# Altium schematic sheet PCBdesign.SchDoc
size A4; Author: Eyke Liegmann; CompanyName: Technische Universität München; Address1: Arcisstr. 21; Address2: 80333 München; Address3: GERMANY; SheetNumber: 1; SheetTotal: 3; CompanyName2: TU München
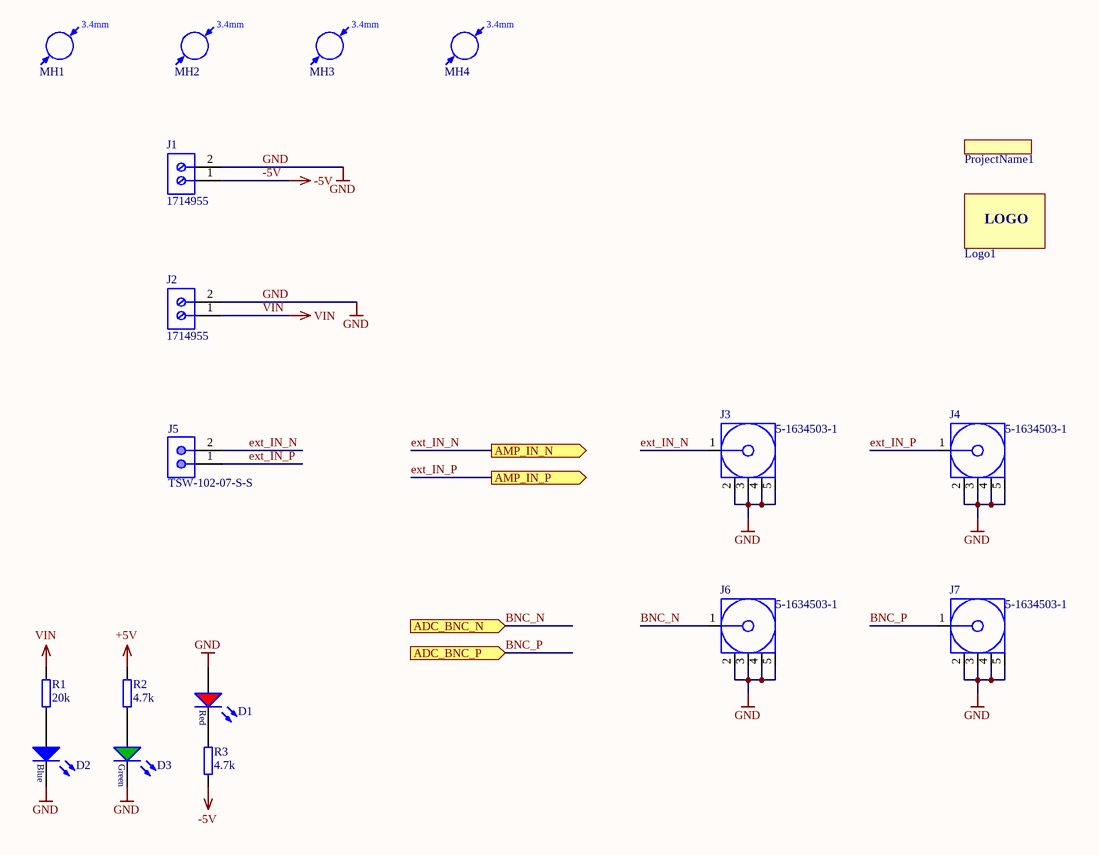
[diagram p0: PCBdesign.SchDoc]

## Parts
D1  150060RS75000  [WL-SMCW_0603]  (value not drawn)
D2  150060BS75000  [WL-SMCW_0603]  (value not drawn)
D3  150060GS75000  [WL-SMCW_0603]  (value not drawn)
J1  1714955  [PHOE-1714955_V]
J2  1714955  [PHOE-1714955_V]
J3  5-1634503-1  [TECO-5-1634503-1_V]
J4  5-1634503-1  [TECO-5-1634503-1_V]
J5  TSW-102-07-S-S  [SMTC-TSW-102-07-S-S]
J6  5-1634503-1  [TECO-5-1634503-1_V]
J7  5-1634503-1  [TECO-5-1634503-1_V]
Logo1  (no value)  [LOGO_Tum]
MH1  mounting hole 3,4mm  [MH_3.4]  (value not drawn)
MH2  mounting hole 3,4mm  [MH_3.4]  (value not drawn)
MH3  mounting hole 3,4mm  [MH_3.4]  (value not drawn)
MH4  mounting hole 3,4mm  [MH_3.4]  (value not drawn)
ProjectName1  Project Name, Rev  [ID_ProjectRev]  (value not drawn)  (no BOM)
R1  20k  [RESC1608X06N]
R2  4.7k  [RESC1608X06N]
R3  4.7k  [RESC1608X06N]

## Ports
ADC_BNC_N (in), ADC_BNC_P (in), AMP_IN_N (out), AMP_IN_P (out)

## Nets
+5V: R2.2
-5V: J1.1 R3.1
GND: D1.2(A) D2.1(K) D3.1(K) J1.2 J2.2 J3.2 J3.3 J3.4 J3.5 J4.2 J4.3 J4.4 J4.5 J6.2 J6.3 J6.4 J6.5 J7.2 J7.3 J7.4 J7.5
VIN: J2.1 R1.2
BNC_N: J6.1 ; port ADC_BNC_N
BNC_P: J7.1 ; port ADC_BNC_P
ext_IN_N: J3.1 J5.2 ; port AMP_IN_N
ext_IN_P: J4.1 J5.1 ; port AMP_IN_P
NetD1_1: D1.1(K) R3.2
NetD2_2: D2.2(A) R1.1
NetD3_2: D3.2(A) R2.1

## Notes on the sheet
- Title
- Size:
- Date:
- A4
- Revision:
- Time:
- Sheet
- of
- Author:
- Project:
- (in symbol Logos) LOGO
- (in symbol Mounting Hole) 3.4mm

## Library data of the parts
D1 = LED_Red_0603: WL-SMCW SMD Mono-color Chip LED Waterclear, size 0603, Red, 2 V, 140°; Forward Voltage: 2 V; Luminous Intensity: 250 mcd; Peak Wavelength: 630 nm; Dominant Wavelength: 625 nm; MF: Wuerth Elektronik; Published Date: Sep. 2017; ComponentLink1Description: Manufacturer; ComponentLink1URL: http://www.we-online.de; ComponentLink2Description: Datasheet; ComponentLink2URL: http://katalog.we-online.com/led/datasheet/150060RS75000.pdf; MPN: 150060RS75000; Size: 0603; Viewing Angle: 140°; Emitting Color: Red; Value: 150060RS75000; Package: 0603; Created: 2018_09_06_AGeiger; Supplier 1: Farnell; Supplier Part Number 1: 2322071; Supplier 2: Mouser; Supplier Part Number 2: 710-150060RS75000; Supplier 3: Digi-Key; Supplier Part Number 3: 732-4978-1-ND
D2 = LED_Blue_0603: WL-SMCW SMD Mono-color Chip LED Waterclear, size 0603, Blue, 3.2 V, 140°; Forward Voltage: 3.2 V; Luminous Intensity: 145 mcd; Peak Wavelength: 465 nm; Dominant Wavelength: 470 nm; MF: Wuerth Elektronik; Published Date: Sep. 2017; ComponentLink1Description: Manufacturer; ComponentLink1URL: http://www.we-online.de; ComponentLink2Description: Datasheet; ComponentLink2URL: http://katalog.we-online.com/led/datasheet/150060BS75000.pdf; MPN: 150060BS75000; Size: 0603; Viewing Angle: 140°; Emitting Color: Blue; Value: 150060BS75000; Package: 0603; Created: 2018_09_06_AGeiger; Supplier 1: Farnell; Supplier Part Number 1: 2322069; Supplier 2: Mouser; Supplier Part Number 2: 710-150060BS75000; Supplier 3: Digi-Key; Supplier Part Number 3: 732-4966-1-ND
D3 = LED_Green_0603: WL-SMCW SMD Mono-color Chip LED Waterclear, size 0603, Green, 3.2 V, 140°; Forward Voltage: 3.2 V; Luminous Intensity: 430 mcd; Peak Wavelength: 515 nm; Dominant Wavelength: 520 nm; MF: Wuerth Elektronik; Published Date: Sep. 2017; ComponentLink1Description: Manufacturer; ComponentLink1URL: http://www.we-online.de; ComponentLink2Description: Datasheet; ComponentLink2URL: http://katalog.we-online.com/led/datasheet/150060GS75000.pdf; MPN: 150060GS75000; Size: 0603; Viewing Angle: 140°; Emitting Color: Green; Value: 150060GS75000; Package: 0603; Created: 2018_09_06_AGeiger; Supplier 1: Farnell; Supplier Part Number 1: 2322070; Supplier 2: Mouser; Supplier Part Number 2: 710-150060GS75000; Supplier 3: Digi-Key; Supplier Part Number 3: 732-4971-1-ND
J1 J2 = 1714955: Conn Terminal Blocks 2 POS 6.35mm Solder ST Thru-Hole 32A; Manufacturer: Phoenix Contact; Max Supply Voltage: 500V; Voltage Rating: 630V; Number of Poles: 2; Number of Levels: 1; Current: 30A; Voltage: 300V; Gender: Male; Connector Type: PCB,Terminal Block; Wire Gauge (Max): 24AWG; Wire Gauge (Min): 10AWG; Stripping Length: 8mm; Approvals: UL,CSA,cULus; Supplier 1: Mouser; Manufacturer Part Number: 1714955; RoHS: Yes; Category: Terminal Blocks; Stock 1: 477; Mount: Through Hole; Number of Pins: 2; Weight: 0.197534oz; Color: Green; Housing Material: Polyamide; Housing Color: Green; Material: Polyamide; Insulation Material: Nylon; Contact Material: Tin; Package Quantity: 50; Packaging: Bulk; Termination: Screw; Max Current Rating: 32A; Current Rating: 32A; Number of Rows: 1; Orientation: Straight; Number of Positions Per Level: 2; Number of Positions: 2; Number of Contacts: 2; Number of Circuits: 2; Length: 12.7mm; Height: 26.6mm; Width: 26.6mm; Pitch: 6.35mm; Depth: 12.5mm; Wire/Cable Gauge: 24AWG; Radiation Hardening: No; Lead Free: Lead Free; Flammability Rating: UL94 V-0; REACH SVHC: No SVHC; ComponentLink1URL: https://datasheet.ciiva.com/16071/1714955-16071953.pdf?src-supplier=Onlinecomponents.com; ComponentLink1Description: https://datasheet.ciiva.com/16071/1714955-16071953.pdf?src-supplier=Onlinecomponents.com; ComponentLink2URL: https://datasheet.ciiva.com/824/1714955-824307.pdf?src-supplier=Digi-Key; ComponentLink2Description: https://datasheet.ciiva.com/824/1714955-824307.pdf?src-supplier=Digi-Key; ComponentLink3URL: https://datasheet.ciiva.com/1120/100944-1120389.pdf?src-supplier=Farnell; ComponentLink3Description: https://datasheet.ciiva.com/1120/100944-1120389.pdf?src-supplier=Farnell; ComponentLink4URL: https://datasheet.ciiva.com/15169/getdatasheetpartid-177883-15169653.pdf?src-supplier=Verical; ComponentLink4Description: https://datasheet.ciiva.com/15169/getdatasheetpartid-177883-15169653.pdf?src-supplier=Verical; ComponentLink5URL: https://datasheet.ciiva.com/1118/100944-1118422.pdf?src-supplier=Element14; ComponentLink5Description: https://datasheet.ciiva.com/1118/100944-1118422.pdf?src-supplier=Element14; ComponentLink6URL: https://datasheet.ciiva.com/14607/70054427-14607514.pdf?src-supplier=Allied+Electronics; ComponentLink6Description: https://datasheet.ciiva.com/14607/70054427-14607514.pdf?src-supplier=Allied+Electronics; ComponentLink7URL: https://datasheet.ciiva.com/29218/744545-da-01-en-printklemme-mkds-5-2-6-35-29218282.pdf?src-supplier=Conrad; ComponentLink7Description: https://datasheet.ciiva.com/29218/744545-da-01-en-printklemme-mkds-5-2-6-35-29218282.pdf?src-supplier=Conrad; Supplier Part Number 1: 651-1714955
J3 J4 J6 J7 = 5-1634503-1: BNC Str PCB Skt 50Ohm Nickel Pltd; Manufacturer: TE Connectivity; Dielectric Material: Polymethylpentene; Body Material: Zinc; Impedance: 50R; Frequency: 4GHz; Gender: Female; Connector Type: BNC,Jack; Insulation Resistance: 5GR; Number of Positions: 1; PCB Mount Retention: With; Sealable: No (Without); Connector System: Cable-to-Board; Polarity: Standard,Normal; PCB Thickness: 0.126inch; Tail Length: 0.177inch; Supplier 1: Mouser; Manufacturer Part Number: 5-1634503-1; RoHS: Yes; Category: RF / Coaxial Connectors; Stock 1: 5615; Mount: Through Hole,PCB; Contact Material: Bronze; Contact Plating: Gold; Insulation Material: Polymethylpentene; Body Plating: Nickel; Min Operating Temperature: -67°C; Max Operating Temperature: 185°C; Orientation: Straight; Termination: Solder; Packaging: Box; Package Quantity: 100; Fastening Type: Bayonet; Max Frequency: 4GHz; Length: 13.7mm; Depth: 11mm; Radiation Hardening: No; ELV: Compliant; REACH SVHC: No SVHC; ComponentLink1URL: https://datasheet.ciiva.com/9421/eng-cd-1634503-c-9421987.pdf?src-supplier=Avnet; ComponentLink1Description: https://datasheet.ciiva.com/9421/eng-cd-1634503-c-9421987.pdf?src-supplier=Avnet; ComponentLink2URL: https://datasheet.ciiva.com/642/eng-cd-1634503-e-642757.pdf?src-supplier=Digi-Key; ComponentLink2Description: https://datasheet.ciiva.com/642/eng-cd-1634503-e-642757.pdf?src-supplier=Digi-Key; ComponentLink3URL: https://datasheet.ciiva.com/30141/eng-cd-1634503-c-30141260.pdf?src-supplier=Onlinecomponents.com; ComponentLink3Description: https://datasheet.ciiva.com/30141/eng-cd-1634503-c-30141260.pdf?src-supplier=Onlinecomponents.com; ComponentLink4URL: https://datasheet.ciiva.com/11762/0900766b806ccb99-11762655.pdf?src-supplier=RSComponents; ComponentLink4Description: https://datasheet.ciiva.com/11762/0900766b806ccb99-11762655.pdf?src-supplier=RSComponents; ComponentLink5URL: https://datasheet.ciiva.com/1448/1663562-1448576.pdf?src-supplier=Element14; ComponentLink5Description: https://datasheet.ciiva.com/1448/1663562-1448576.pdf?src-supplier=Element14; ComponentLink6URL: https://datasheet.ciiva.com/16652/eng-cd-1634503-c-16652893.pdf?src-supplier=Avnet+Europe; ComponentLink6Description: https://datasheet.ciiva.com/16652/eng-cd-1634503-c-16652893.pdf?src-supplier=Avnet+Europe; Supplier Part Number 1: 571-5-1634503-1
J5 = TSW-102-07-S-S: SAMTEC         TSW-102-07-S-S             CONNECTOR, HEADER, 2 POSITION, 1ROW, 2.54MM; Number of Contacts: 2; Gender: Male; Connector Type: Male Pin; Max Current Rating: 7.6A; Max Voltage Rating (AC): 550V; Supplier 1: Mouser; Manufacturer: Samtec; Manufacturer Part Number: TSW-102-07-S-S; RoHS: Yes; Category: Headers and Wire Housings; Stock 1: 9923; Mount: Through Hole; Contact Material: Bronze; Housing Material: Polyester; Contact Plating: Gold; Color: Black; Housing Color: Black; Min Operating Temperature: -55°C; Max Operating Temperature: 125°C; Packaging: Bulk; Number of Rows: 1; Termination: Solder; Number of Positions: 2; Orientation: Straight; Package Quantity: 1; Length: 5.08mm; Pitch: 2.54mm; Depth: 2.54mm; Contact Mating Length: 0.23inch; Width: 2.54mm; Radiation Hardening: No; REACH SVHC: No SVHC; Lead Free: Lead Free; ComponentLink1URL: https://datasheet.ciiva.com/28366/1796313-28366300.pdf?src-supplier=Element14; ComponentLink1Description: https://datasheet.ciiva.com/28366/1796313-28366300.pdf?src-supplier=Element14; ComponentLink2URL: https://datasheet.ciiva.com/16734/htsw-th-16734222.pdf?src-supplier=Avnet+Europe; ComponentLink2Description: https://datasheet.ciiva.com/16734/htsw-th-16734222.pdf?src-supplier=Avnet+Europe; Supplier Part Number 1: 200-TSW10207SS
Logo1 = Logos
MH1-MH4 = Mounting Hole: Non plated through hole, 3.4mm
ProjectName1 = ID_ProjectRev: Project Name and Revision Number; Created: 2018_11_23_AGeiger; Value: Project Name, Rev
R1 = R_0603: MPN: Vishay / Dale; MF: CRCW060320K0JNEAC; Value: 20k; Supplier 1: Mouser; Supplier Part Number 1: 71-CRCW060320K0JNEAC; Package: 0603
R2 R3 = R_0603: MPN: CRCW06034K70JNEAC; MF: Vishay / Dale; Value: 4.7k; Supplier 1: Mouser; Supplier Part Number 1: 71-CRCW06034K70JNEAC; Package: 0603